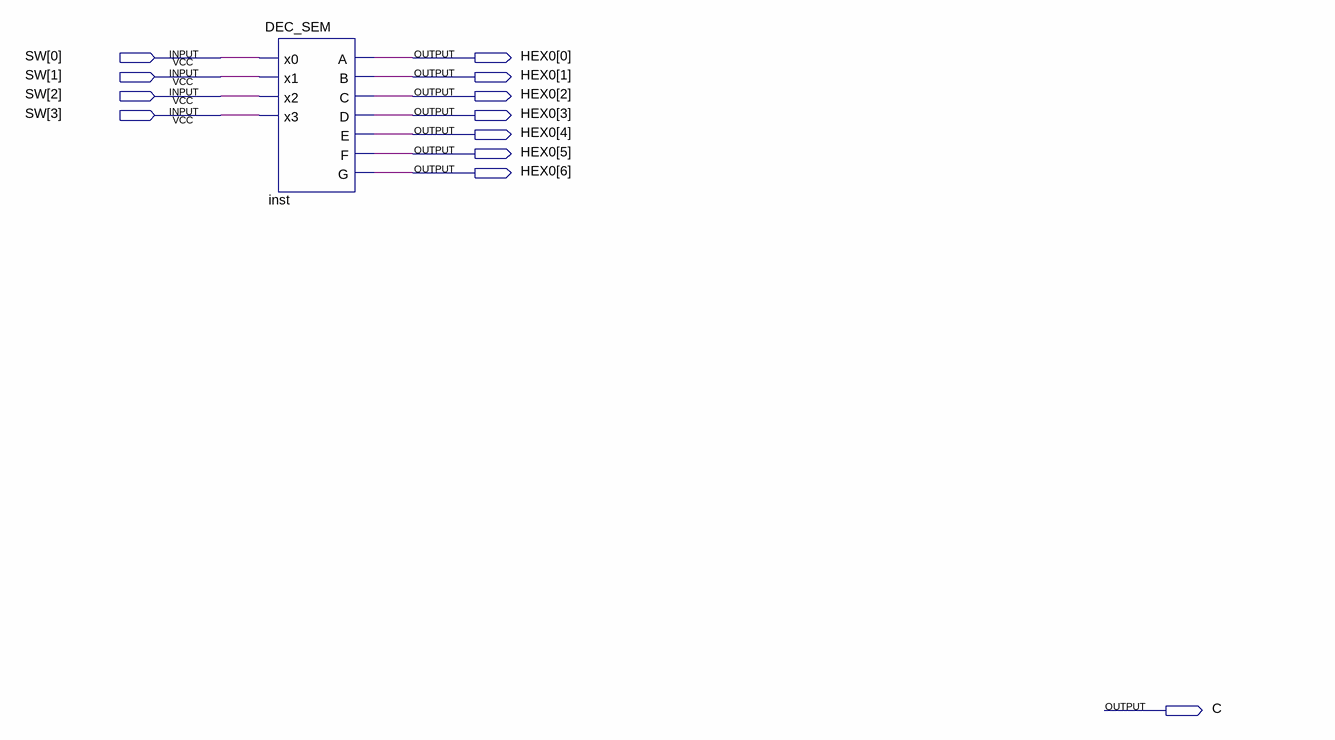
[diagram p0: schematic sheet]
// Quartus schematic Lab1.bdf as structural Verilog: 1 symbols, 12 pins
module Lab1 (
  input  [3:0] SW,
  output [6:0] HEX0,
  output C
);

  DEC_SEM inst (
    .x0(SW[0]), .x1(SW[1]), .x2(SW[2]), .x3(SW[3]), .A(HEX0[0]), .B(HEX0[1]), .C(HEX0[2]), .D(HEX0[3]),
    .E(HEX0[4]), .F(HEX0[5]), .G(HEX0[6]));
endmodule
